# EAGLE design realy_wifi_obd (EAGLE 9.6.0)
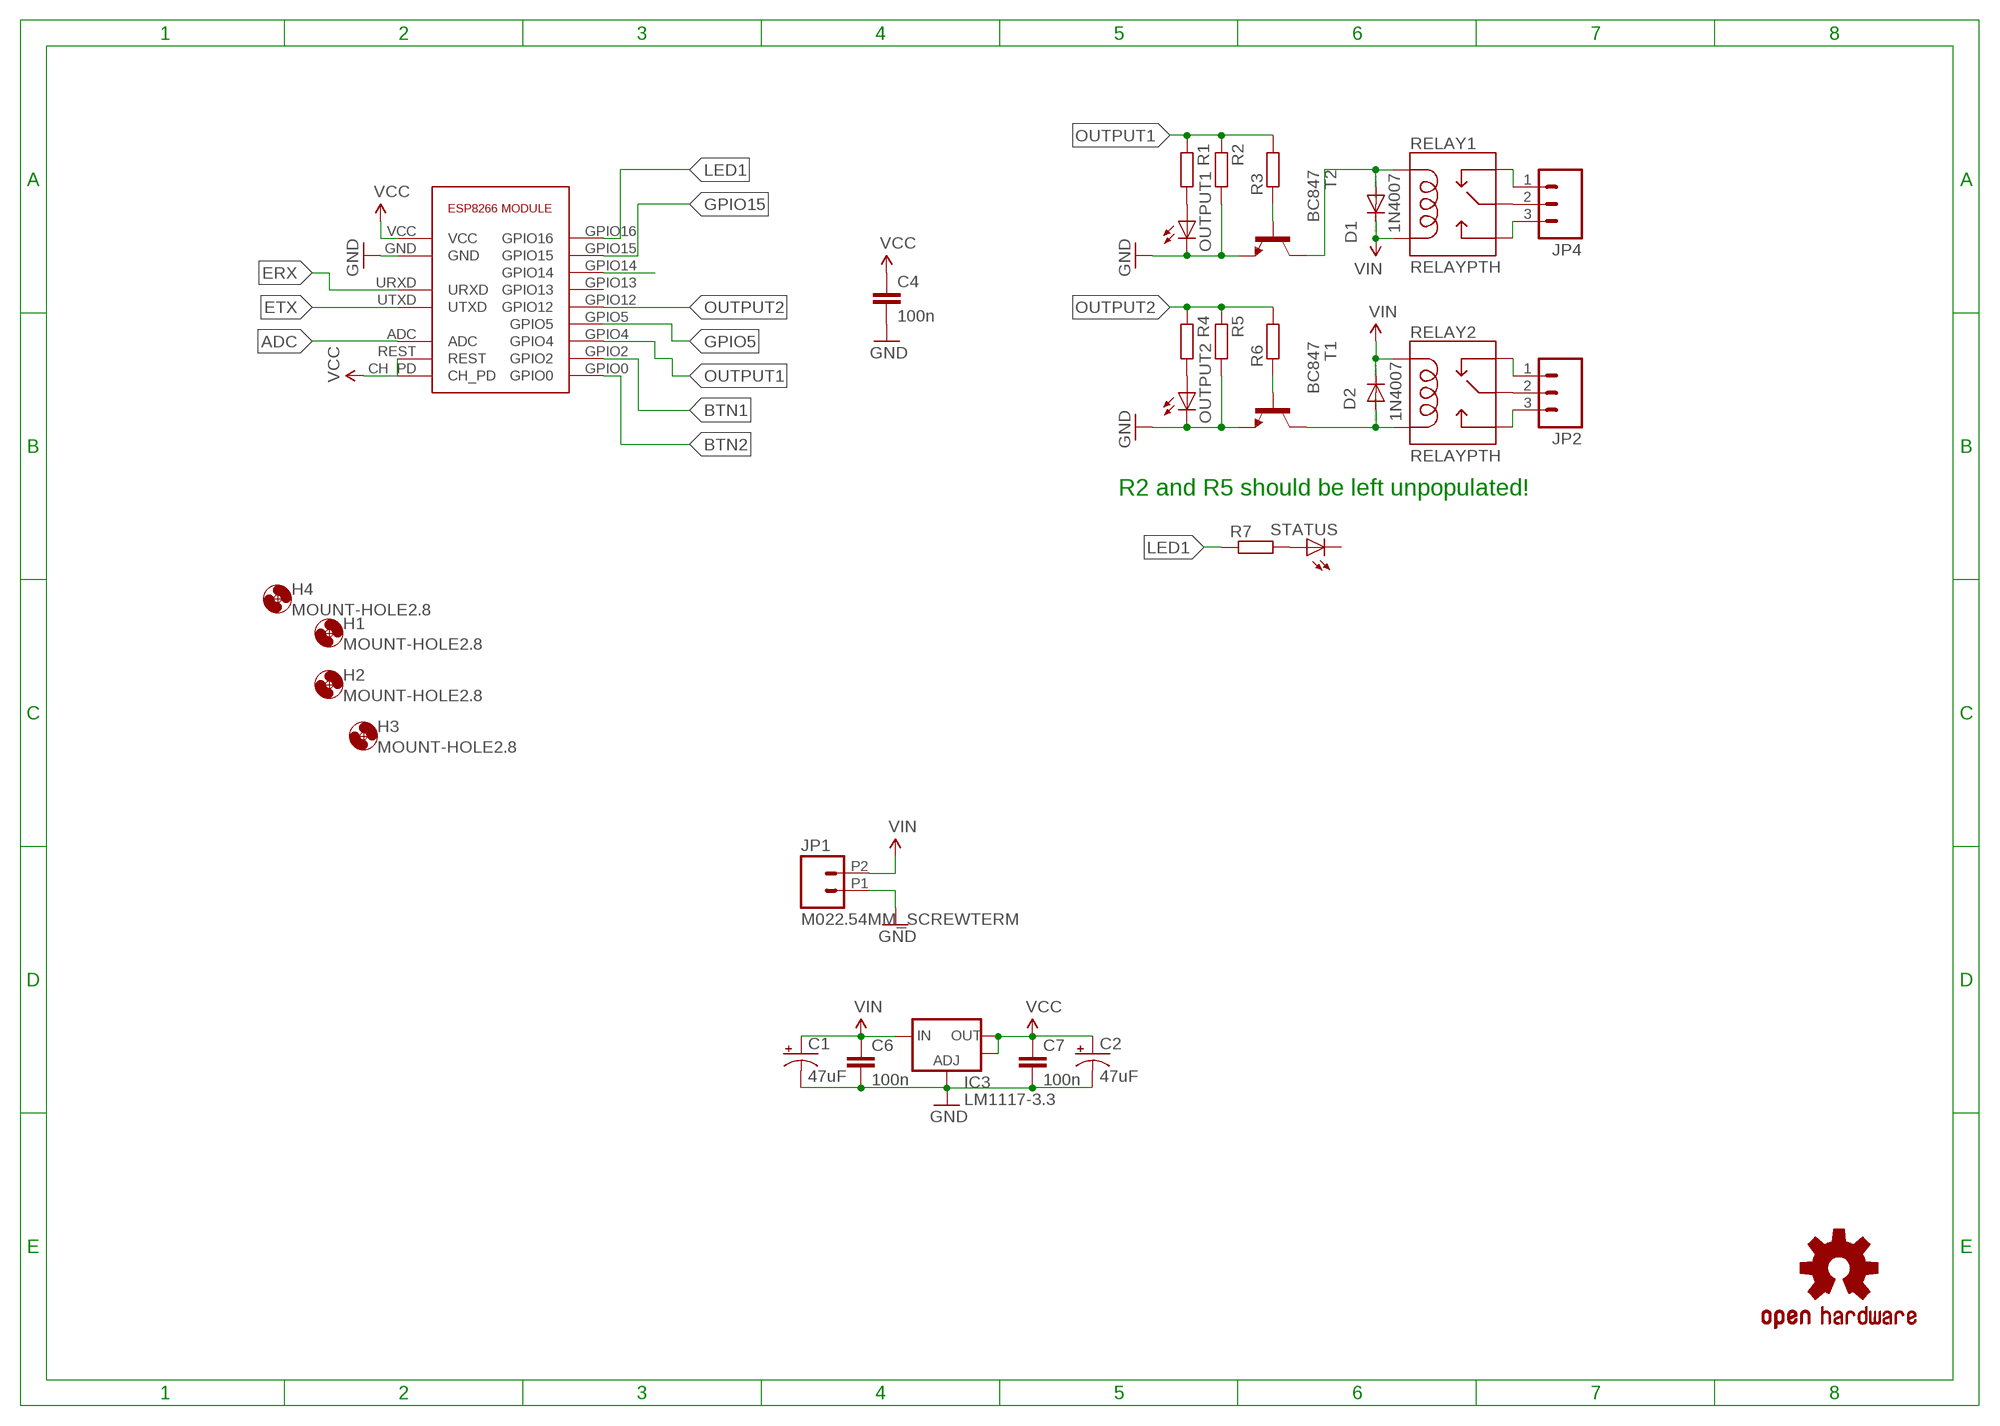
[diagram p0: schematic, sheet 1]

## Parts
C1  47uF  CAP_POLD  [PANASONIC_D]
C2  47uF  CAP_POLD  [PANASONIC_D]
C4  100n  C-EUC0805K  [C0805K]
C6  100n  C-EUC0805K  [C0805K]
C7  100n  C-EUC0805K  [C0805K]
D1  1N4942  [DO41-10]
D2  1N4942  [DO41-10]
ESP8266  ESP8266ESP-07  [ESP-12]
H1  MOUNT-HOLE2.8  [2,8]
H2  MOUNT-HOLE2.8  [2,8]
H3  MOUNT-HOLE2.8  [2,8]
H4  MOUNT-HOLE2.8  [2,8]
IC3  LM1117-3.3  V_REG_LM1117SOT223  [SOT223]
JP1  M022.54MM_SCREWTERM  [1X02_2.54_SCREWTERM]
JP2  M03-SCREW-5MM  [SCREWTERMINAL-5MM-3]
JP4  M03-SCREW-5MM  [SCREWTERMINAL-5MM-3]
LOGO1  OSHW-LOGOL  [OSHW-LOGO-L]
OUTPUT1  LEDCHIP-LED0805  [CHIP-LED0805]
OUTPUT2  LEDCHIP-LED0805  [CHIP-LED0805]
R1  SMARTPRJ_R-EU_M0805  [SMARTPRJ_M0805]
R2  SMARTPRJ_R-EU_M0805  [SMARTPRJ_M0805]
R3  SMARTPRJ_R-EU_M0805  [SMARTPRJ_M0805]
R4  SMARTPRJ_R-EU_M0805  [SMARTPRJ_M0805]
R5  SMARTPRJ_R-EU_M0805  [SMARTPRJ_M0805]
R6  SMARTPRJ_R-EU_M0805  [SMARTPRJ_M0805]
R7  SMARTPRJ_R-EU_M0805  [SMARTPRJ_M0805]
RELAY1  RELAYPTH  [SRD-05VDC-SL-C]
RELAY2  RELAYPTH  [SRD-05VDC-SL-C]
STATUS  LEDCHIP-LED0805  [CHIP-LED0805]
T1  BC847  [SOT23]
T2  BC847  [SOT23]

## Nets
ADC: ESP8266.ADC
BTN1: ESP8266.GPIO2
BTN2: ESP8266.GPIO0
DHT22: ESP8266.GPIO14
ERX: ESP8266.URXD
ETX: ESP8266.UTXD
GND: C1.- C2.- C4.2 C6.2 C7.2 ESP8266.GND IC3.1(ADJ) JP1.P1 OUTPUT1.C OUTPUT2.C R2.2 R5.2 T1.2(E) T2.2(E)
GPIO5: ESP8266.GPIO5
GPIO15: ESP8266.GPIO15
LED1: ESP8266.GPIO16 R7.1
N$1: D2.A RELAY2.COIL0 T1.3(C)
N$2: D1.A RELAY1.COIL1 T2.3(C)
N$3: JP2.2 RELAY2.SWCOMMON
N$4: JP4.2 RELAY1.SWCOMMON
N$5: JP4.1 RELAY1.SWCLOSED(SWCLOSE)
N$6: JP4.3 RELAY1.SWOPEN
N$7: JP2.3 RELAY2.SWOPEN
N$8: JP2.1 RELAY2.SWCLOSED(SWCLOSE)
N$9: R3.1 T2.1(B)
N$10: R6.1 T1.1(B)
N$13: OUTPUT2.A R4.2
N$14: R7.2 STATUS.A
N$17: OUTPUT1.A R1.2
OUTPUT1: ESP8266.GPIO4 R1.1 R2.1 R3.2
OUTPUT2: ESP8266.GPIO12 R4.1 R5.1 R6.2
VCC: C2.+ C4.1 C7.1 ESP8266.CH_PD ESP8266.REST ESP8266.VCC IC3.2(OUT) IC3.4(OUT)
VIN: C1.+ C6.1 D1.C D2.C IC3.3(IN) JP1.P2 RELAY1.COIL0 RELAY2.COIL1
Unconnected: ESP8266.GPIO13 STATUS.C

## Notes on the sheet
- 1N4007
- 1N4007
- R2 and R5 should be left unpopulated!

## Library data of the parts
C1 C2 = SparkFun-Capacitors:CAP_POL: Capacitor Polarized These are standard SMD and PTH capacitors. Normally 10uF, 47uF, and 100uF in electrolytic and tantalum varieties. Always verify the external diameter of the through hole cap, it varies with capacity, voltage, and manufacturer. The EIA devices should be standard.
C4 C6 C7 = rcl:C-EU: CAPACITOR, European symbol
D1 D2 = diode:1N4942: DIODE 1.0 A, 200 V, 150 ns
ESP8266 = esp:ESP8266
H1-H4 = holes:MOUNT-HOLE: MOUNTING HOLE with drill center marker
IC3 = SparkFun-PowerIC:V_REG_LM1117: Voltage Regulator LM1117 Standard adjustable voltage regulator but in SMD form. Spark Fun Electronics SKU : COM-00595
JP1 = SparkFun-Connectors:M02: Standard 2-pin 0.1" header. Use with - straight break away headers ( PRT-00116) - right angle break away headers (PRT-00553) - swiss pins (PRT-00743) - machine pins (PRT-00117) - female headers (PRT-00115) Molex polarized connector foot print use with: PRT-08233 with associated crimp pins and housings. 2.54_SCREWTERM for use with PRT-10571. 3.5mm Screw Terminal footprints for PRT-08084 5mm Screw Terminal footprints for use with PRT-08432
JP2 JP4 = SparkFun-Connectors:M03: Header 3 Standard 3-pin 0.1" header. Use with straight break away headers (SKU : PRT-00116), right angle break away headers (PRT-00553), swiss pins (PRT-00743), machine pins (PRT-00117), and female headers (PRT-00115). Molex polarized connector foot print use with SKU : PRT-08232 with associated crimp pins and housings.; STOREFRONT_ID: PRT-08433
LOGO1 = SparkFun-Aesthetics:OSHW-LOGO: Open Source Hardware Logo This logo indicates the piece of hardware it is found on incorporates a OSHW license and/or adheres to the definition of open source hardware found here: http://freedomdefined.org/OSHW
OUTPUT1 OUTPUT2 STATUS = led:LED: LED OSRAM: - CHIPLED LG R971, LG N971, LY N971, LG Q971, LY Q971, LO R971, LY R971 LH N974, LH R974 LS Q976, LO Q976, LY Q976 LO Q996 - Hyper CHIPLED LW Q18S LB Q993, LB Q99A, LB R99A - SideLED LS A670, LO A670, LY A670, LG A670, LP A670 LB A673, LV A673, LT A673, LW A673 LH A674 LY A675 LS A676, LA A676, LO A676, LY A676, LW A676 LS A679, LY A679, LG A679 - Hyper Micro SIDELED® LS Y876, LA Y876, LO Y876, LY Y876 LT Y87S - SmartLED LW L88C, LW L88S LB L89C, LB L89S, LG L890 LS L89K, LO L89K, LY L89K LS L896, LA L896, LO L896, LY L896 - TOPLED LS T670, LO T670, LY T670, LG T670, LP T670 LSG T670, LSP T670, LSY T670, LOP T670, LYG T670 LG T671, LOG T671, LSG T671 LB T673, LV T673, LT T673, LW T673 LH T674 LS T676, LA T676, LO T676, LY T676, LB T676, LH T676, LSB T676, LW T676 LB T67C, LV T67C, LT T67C, LS T67K, LO T67K, LY T67K, LW E67C LS E67B, LA E67B, LO E67B, LY E67B, LB E67C, LV E67C, LT E67C LW T67C LS T679, LY T679, LG T679 LS T770, LO T770, LY T770, LG T770, LP T770 LB T773, LV T773, LT T773, LW T773 LH T774 LS E675, LA E675, LY E675, LS T675 LS T776, LA T776, LO T776, LY T776, LB T776 LHGB T686 LT T68C, LB T68C - Hyper Mini TOPLED® LB M676 - Mini TOPLED Santana® LG M470 LS M47K, LO M47K, LY M47K Source: http://www.osram.convergy.de LUXEON: - LUMILED® LXK2-PW12-R00, LXK2-PW12-S00, LXK2-PW14-U00, LXK2-PW14-V00 LXK2-PM12-R00, LXK2-PM12-S00, LXK2-PM14-U00 LXK2-PE12-Q00, LXK2-PE12-R00, LXK2-PE12-S00, LXK2-PE14-T00, LXK2-PE14-U00 LXK2-PB12-K00, LXK2-PB12-L00, LXK2-PB12-M00, LXK2-PB14-N00, LXK2-PB14-P00, LXK2-PB14-Q00 LXK2-PR12-L00, LXK2-PR12-M00, LXK2-PR14-Q00, LXK2-PR14-R00 LXK2-PD12-Q00, LXK2-PD12-R00, LXK2-PD12-S00 LXK2-PH12-R00, LXK2-PH12-S00 LXK2-PL12-P00, LXK2-PL12-Q00, LXK2-PL12-R00 Source: www.luxeon.com KINGBRIGHT: KA-3528ASYC Source: www.kingbright.com
R1-R7 = arduino_Uno_Rev3-02-TH:SMARTPRJ_R-EU_: RESISTOR, European symbol
RELAY1 RELAY2 = srd-05vdc-sl-c:RELAY: SPDT relay (COM-00101)
T1 T2 = transistor:BC847: NPN TRANSISTOR

## Net classes
0 default: clearance 0.205 mm

## Board
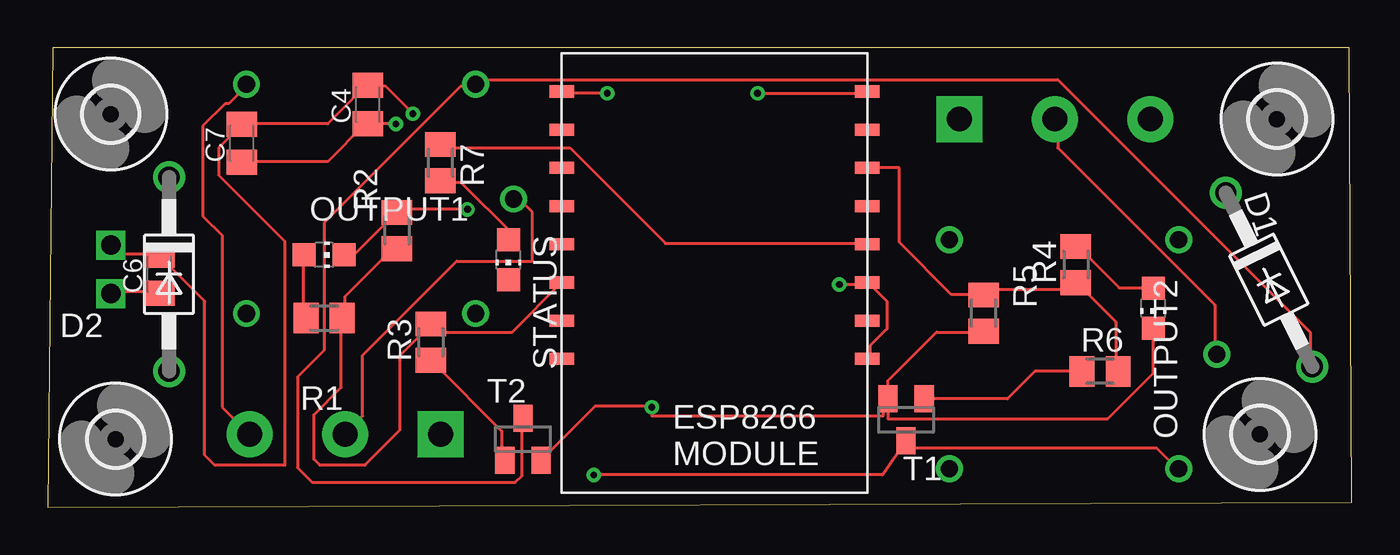
[diagram p1: board, top side]
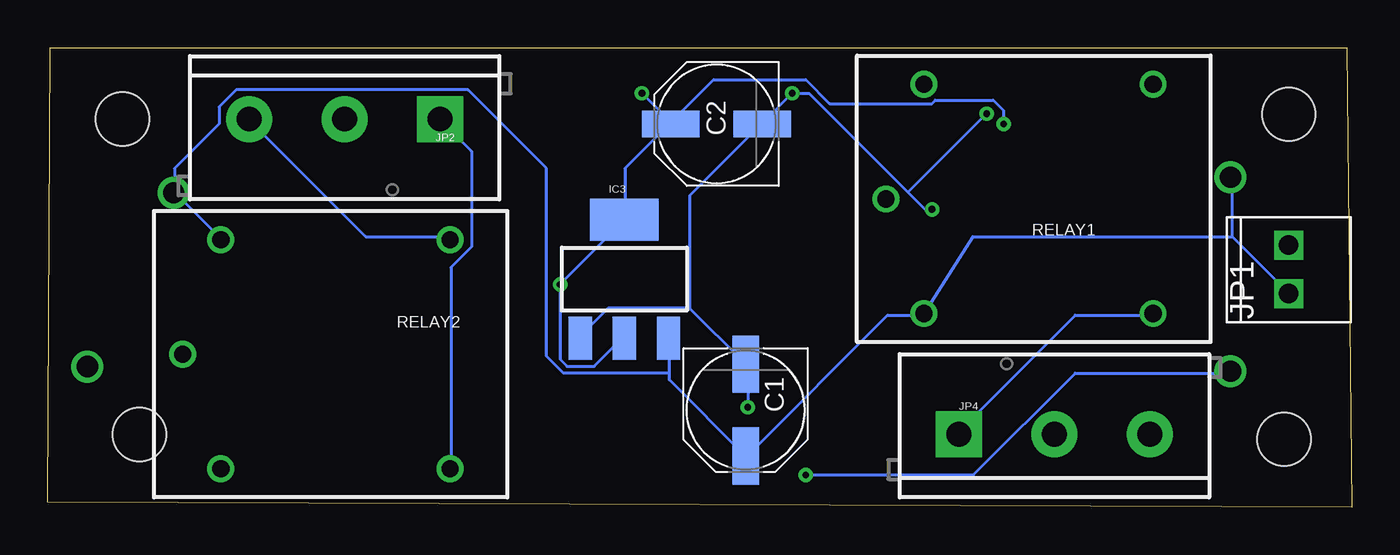
[diagram p2: board, bottom side, seen from below]

Size 68.31 x 24.05 mm. Coordinates in mm from the lower left corner, seen from the top.
Outline: 0,0 68.31,0.25 68.18,24.05 0.25,24.05 0,0
Copper layers (1*16): Top 0.035mm / dielectric 1.5mm / Bottom 0.035mm
Design rules "default": minimum track width 6mil, minimum drill 0.35mm, track to track 6mil, track to pad 6mil, pad to pad 6mil, via to via 6mil, smd to smd 6mil, copper to edge 40mil, drill to drill 6mil, minimum pad ring 10mil, minimum via ring 8mil, stop-mask expansion 4mil, vias tented up to drill 0mil, thermal gap 10mil

### Footprints (pad centres in the part's own frame; a part is rotated, then mirrored left to right if it is on the bottom)
PANASONIC_D = smd 3 x 1.4: + 2.4,0; - -2.4,0
C0805K = smd 1.3 x 1.6: 1 -1,0; 2 1,0
DO41-10 = drill 1.118: A 5.08,0; C -5.08,0
ESP-12 = smd 0.635 x 1.27: ADC 9,0; CH_PD 11,0; GND 21,16; GPIO0 15,16; GPIO2 17,16; GPIO4 11,16; GPIO5 13,16; GPIO12 17,0; GPIO13 19,0; GPIO14 15,0; GPIO15 19,16; GPIO16 13,0; REST 7,0; URXD 9,16; UTXD 7,16; VCC 21,0
2,8 = hole 2.8: 0,0
SOT223 = smd 1.219 x 2.235: 1 -2.311,-3.099; 2 0,-3.099; 3 2.311,-3.099 | smd 3.6 x 2.2: 4 0,3.099
1X02_2.54_SCREWTERM = drill 1.016 square: P1 2.54,0; P2 0,0
SCREWTERMINAL-5MM-3 = drill 1.3 pad 2.413 square: 1 0,0 | drill 1.3 pad 2.413: 2 5,0; 3 10,0
CHIP-LED0805 = smd 1.2 x 1.2: A 0,-1.05; C 0,1.05
SMARTPRJ_M0805 = smd 1.3 x 1.6: 1 -0.95,0; 2 0.95,0
SRD-05VDC-SL-C = drill 0.9: COIL0 -5.39,-6.12; COIL1 -5.39,5.88; SWCLOSED 6.61,-6.12; SWCOMMON -7.39,-0.12; SWOPEN 6.61,5.88
SOT23 = smd 1 x 1.4: 1 -0.95,-1.1; 2 0.95,-1.1; 3 0,1.1

### Placement (x,y rotation side)
C1  31.75,5.08 270 bottom
C2  33.27,20.07 180 bottom
C4  16.76,21.08 90 top
C6  5.84,12.19 90 top
C7  10.16,19.05 90 top
D1  63.97,11.91 296.4 top
D2  6.35,12.19 270 top
ESP8266  42.93,0.76 90 top
H1  3.56,3.56 0 top
H2  64.39,20.32 0 top
H3  63.5,3.81 0 top
H4  3.3,20.57 0 top
IC3  38.1,11.94 0 bottom
JP1  3.3,11.18 90 bottom
JP2  47.75,20.32 180 bottom
JP4  20.57,3.81 0 bottom
LOGO1  -66.55,78.23 0 top  (outside the outline)
OUTPUT1  14.48,13.21 270 top
OUTPUT2  57.91,10.41 180 top
R1  14.48,9.91 180 top
R2  18.29,14.48 90 top
R3  20.07,8.64 90 top
R4  53.85,12.7 90 top
R5  49.02,10.16 270 top
R6  55.12,7.11 0 top
R7  20.57,18.03 270 top
RELAY1  17.02,16.26 0 bottom
RELAY2  53.85,8.13 0 bottom
STATUS  24.13,12.95 180 top
T1  44.96,4.57 180 top
T2  24.89,3.56 0 top

### Tracks (layer width: path | path; a pad name or v marks a point on that pad's centre or on a via)
GND  (via drill 0.35)
  Top 0.152: OUTPUT2.C 57.91,9.34 57.91,7.02 55.53,4.64 44.01,4.64 T1.2 | T2.2 28.66,5.28 31.64,5.28 | T1.2 43.75,5.42 43.75,4.77 31.64,4.77 v31.64,5.23 | T1.2 44.01,6.61 46.55,9.16 48.97,9.16 R5.2 | JP1.P1 3.4,13.63 3.76,13.27 5.73,13.27 C6.2 5.91,13.09 8.23,10.77 8.23,2.71 8.75,2.19 12.41,2.19 12.41,13.91 8.94,17.38 8.94,18.81 10.02,19.88 C7.2 10.2,20.06 14.66,20.06 16.63,22.03 C4.2 16.81,22.03 17.7,22.03 v19.13,20.6 | OUTPUT1.C 15.56,13.27 16.09,13.27 18.24,15.42 R2.2 18.42,15.59 v21.99,15.59 | v29.32,21.67 26.99,21.67 ESP8266.GND
  Bottom 0.152: 34.68,10.41 38.97,10.41 40.4,8.98 IC3.1 | 34.68,10.41 31.82,7.55 C1.- 31.64,7.37 v31.64,5.23 | v21.99,15.59 22.35,15.59 23.24,16.49 | 23.24,16.49 28.42,21.67 v29.32,21.67 30.75,20.24 C2.- 30.92,20.06 34.68,16.31 34.68,10.41 | 23.24,16.49 v19.13,20.6
LED1
  Top 0.152: ESP8266.GPIO16 42.9,13.81 32.35,13.81 27.35,18.81 20.74,18.81 R7.1
N$1  (via drill 0.35)
  Top 0.152: RELAY2.COIL0 59.16,2.01 58.09,3.08 45.19,3.08 T1.3 43.72,1.68 v28.61,1.68
  Bottom 0.152: v28.61,1.68 19.82,1.68 14.48,7.02 6.44,7.02 D2.A
N$2
  Top 0.152: T2.3 24.85,4.52 24.85,1.66 24.49,1.3 13.85,1.3 13.08,2.07 13.08,6.82 14.48,8.22 14.48,14.88 21.63,22.03 22.35,22.03 RELAY1.COIL1 22.53,22.21 22.7,22.39 52.9,22.39 66.13,9.16 66.13,7.37 D1.A
N$3
  Top 0.152: RELAY2.SWCOMMON 61.12,8.09 61.12,10.59 52.9,18.81 52.9,20.24 JP2.2
N$4
  Top 0.152: RELAY1.SWCOMMON 24.68,16.14 25.38,15.43 25.38,12.88 21.43,12.88 16.5,7.96 16.5,4.78 JP4.2
N$5
  Bottom 0.152: RELAY1.SWCLOSED 10.55,10.05 14.48,10.05 20.56,3.98 JP4.1
N$6
  Top 0.152: RELAY1.SWOPEN 10.37,22.03 9.48,21.13 9.3,21.13 8.13,19.96 8.13,15.24 9.14,14.22 9.14,5.24 JP4.3 10.55,3.98
N$7
  Bottom 0.152: RELAY2.SWOPEN 47.36,14.16 51.65,14.16 57.73,20.24 JP2.3
N$8
  Bottom 0.152: RELAY2.SWCLOSED 47.19,2.01 47.19,12.56 46.11,13.63 46.11,18.63 47.72,20.24 JP2.1
N$9
  Top 0.152: T2.1 23.78,2.55 23.78,3.98 20.2,7.55 R3.1
N$10
  Top 0.152: R6.1 51.71,7.11 50.27,5.67 T1.1
N$13
  Top 0.152: OUTPUT2.A 57.91,11.48 56.12,11.48 53.98,13.63 R4.2
N$14
  Top 0.152: STATUS.A 24.31,14.34 21.63,17.02 20.74,17.02 R7.2
N$17
  Top 0.152: OUTPUT1.A 13.41,13.09 13.41,10.05 R1.2
OUTPUT1
  Top 0.152: R2.1 18.06,13.53 15.56,11.02 15.56,10.05 R1.1 15.38,9.88 15.38,6.27 13.95,4.84 13.95,2.5 14.26,2.19 16.6,2.19 18.44,4.04 18.44,7.94 20.02,9.52 R3.2 | 20.74,8.98 20.2,9.52 R3.2 | R3.2 20.3,9.36 20.3,9.33 20.48,9.15 24.32,9.15 ESP8266.GPIO4
OUTPUT2
  Top 0.152: ESP8266.GPIO12 44.6,17.76 44.6,13.87 47.34,11.13 48.97,11.13 R5.1 49.15,11.13 49.43,11.41 53.65,11.41 R4.1 53.98,11.66 55.94,9.7 55.94,7.2 R6.2
VCC  (via drill 0.35)
  Top 0.152: ESP8266.REST 43.08,7.91 43.08,8.45 43.97,9.34 43.97,10.77 43.08,11.66 ESP8266.CH_PD 42.9,11.66 v41.47,11.66 | C7.1 10.2,18.1 14.66,18.1 16.63,20.06 C4.1 16.81,20.06 v18.24,20.06 | v37.18,21.67 42.9,21.67 ESP8266.VCC
  Bottom 0.152: IC3.2 38.25,8.8 39.68,7.37 41.11,7.37 41.47,7.73 v41.47,11.66 38.25,14.88 IC3.4 38.07,15.06 38.07,17.74 35.75,20.06 C2.+ | v37.18,21.67 35.75,20.24 C2.+ | v18.24,20.06 18.24,20.78 18.77,21.31 21.81,21.31 21.99,21.13 27.35,21.13 28.6,22.39 33.43,22.39 35.57,20.24 C2.+
VIN
  Top 0.152: C6.1 5.73,11.3 3.4,11.3 JP1.P2
  Bottom 0.152: 6.26,14.16 6.26,17.2 D2.C | 6.26,14.16 3.4,11.3 JP1.P2 | 61.66,16.49 59.34,14.16 RELAY2.COIL1 | 35.75,7.02 35.75,6.66 31.82,2.73 C1.+ 31.64,2.73 24.31,10.05 22.53,10.05 RELAY1.COIL0 19.86,14.16 6.26,14.16 | 35.75,7.02 35.75,8.8 IC3.3 | 61.66,16.49 61.66,17.74 59.34,20.06 59.34,20.96 58.44,21.85 46.29,21.85 42.18,17.74 42.18,7.91 41.29,7.02 35.75,7.02 | 61.66,16.49 D1.C